# Altium schematic sheet ESP32_2020-10-03_09-20-40.schdoc
size 281 x 190 mm
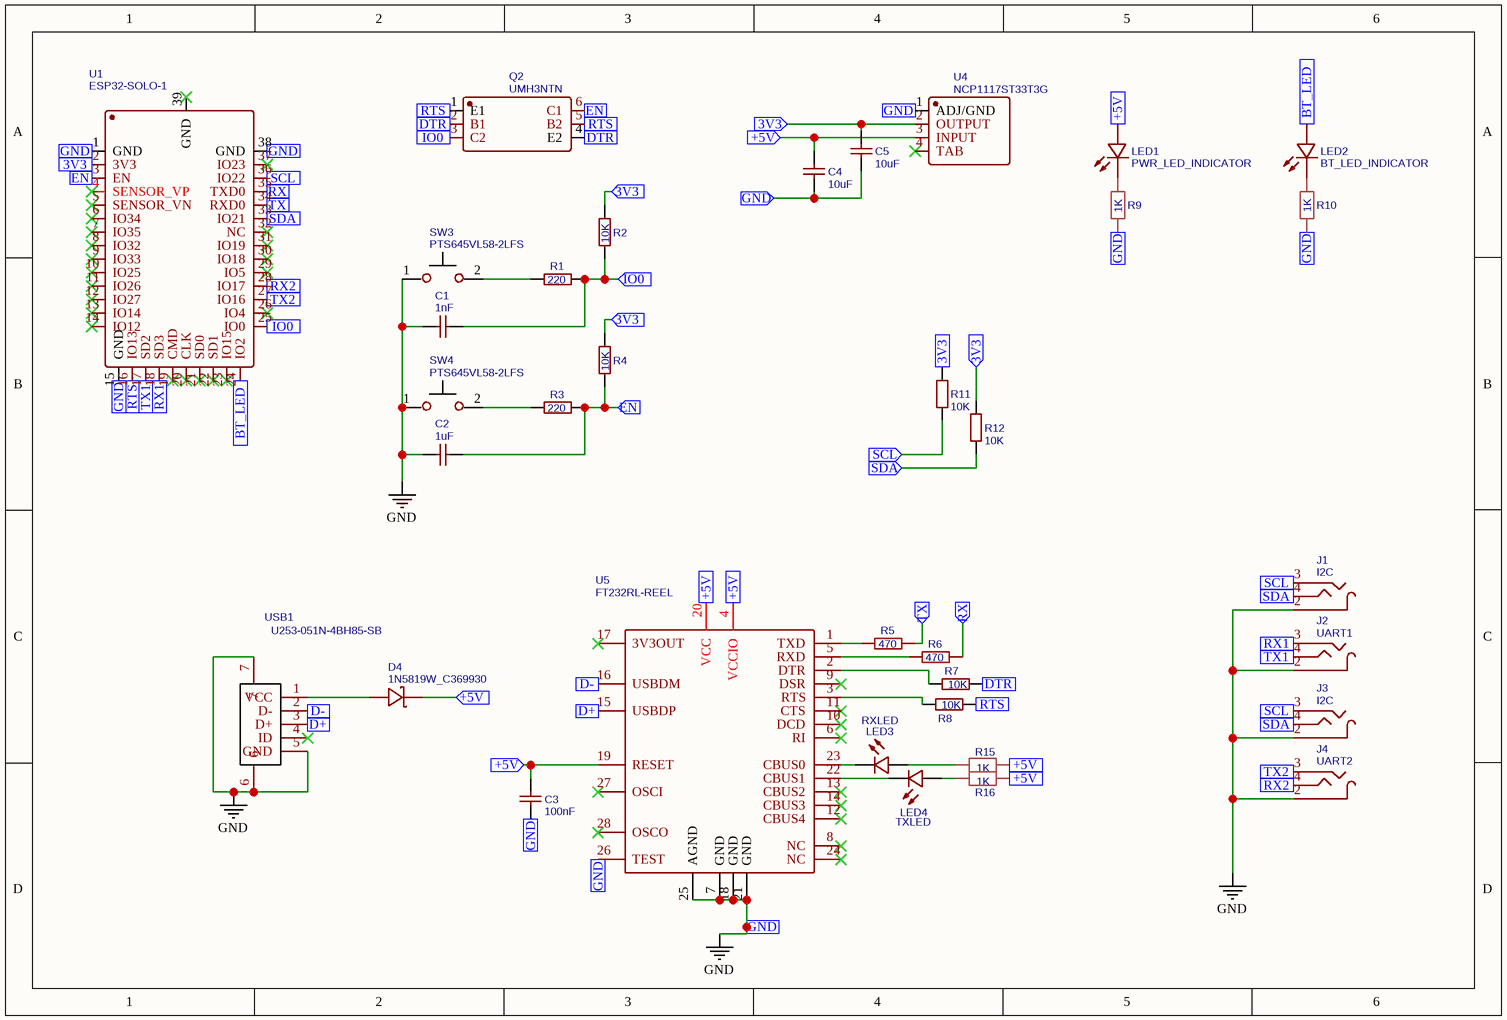
[diagram p0: ESP32_2020-10-03_09-20-40.schdoc]

## Parts
C1  1nF  [C1206]
C2  1uF  [C1206]
C3  100nF  [C1206]
C4  10uF  [C1206]
C5  10uF  [C1206]
D4  1N5819W_C369930  [SOD-123_L2.8-W1.8-LS3.7-RD]
J1  I2C  [AUDIO-TH_PJ313D]
J2  UART1  [AUDIO-TH_PJ313D]
J3  I2C  [AUDIO-TH_PJ313D]
J4  UART2  [AUDIO-TH_PJ313D]
LED1  PWR_LED_INDICATOR  [LED1206-R-RD]
LED2  BT_LED_INDICATOR  [LED1206-R-RD]
LED3  RXLED  [LED1206-R-RD]
LED4  TXLED  [LED1206-R-RD]
Q2  UMH3NTN  [SOT-363_L2.0-W1.3-P0.65-LS2.1-TL]
R1  220  [R1206]
R2  10K  [R1206]
R3  220  [R1206]
R4  10K  [R1206]
R5  470  [R1206]
R6  470  [R1206]
R7  10K  [R1206]
R8  10K  [R1206]
R9  1K  [_1206MP]
R10  1K  [_1206MP]
R11  10K  [R1206]
R12  10K  [R1206]
R15  1K  [_1206MP]
R16  1K  [_1206MP]
SW3  PTS645VL58-2LFS  [KEY-7.0*7.0]
SW4  PTS645VL58-2LFS  [KEY-7.0*7.0]
U1  ESP32-SOLO-1  [WIFIM-SMD_38P-L25.5-W18.0-P1.27]
U4  NCP1117ST33T3G  [SOT-223-3_L6.5-W3.4-P2.30-LS7.0-BR]
U5  FT232RL-REEL  [SSOP-28_L10.2-W5.3-P0.65-LS7.8-BL]
USB1  U253-051N-4BH85-SB  [MICRO-USB-SMD_U253-051T-4BH85-SB]

## Ports
3V3 (in), +5V (in), BT_LED (in), D+ (in), D- (in), DTR (in), EN (in), GND (in), IO0 (in), RTS (in), RX1 (in), RX2 (in), RX (in), SCL (in), SDA (in), TX1 (in), TX2 (in), TX (in)

## Nets
GND: C1.1 C2.1 C3.1 C4.1 C5.1 J1.2 J2.2 J3.2 J4.2 R9.1 R10.1 SW3.1 SW4.1 U1.1(GND) U1.15(GND) U1.38(GND) U4.1(ADJ/GND) U5.7(GND) U5.18(GND) U5.21(GND) U5.25(AGND) U5.26(TEST) USB1.5(GND) USB1.6 USB1.7 ; port GND
3V3: C5.2 R2.2 R4.2 R11.2 R12.2 U1.2(3V3) U4.2(OUTPUT) ; port 3V3
+5V: C3.2 C4.2 D4.1(K) LED1.1(A) R15.2 R16.2 U4.3(INPUT) U5.4(VCCIO) U5.19(RESET) U5.20(VCC) ; port +5V
BT_LED: LED2.1(A) U1.24(IO2) ; port BT_LED
D+: U5.15(USBDP) USB1.3(D+) ; port D+
D-: U5.16(USBDM) USB1.2(D-) ; port D-
DTR: Q2.2(B1) Q2.4(E2) R7.2 ; port DTR
EN: C2.2 Q2.6(C1) R3.2 R4.1 U1.3(EN) ; port EN
IO0: C1.2 Q2.3(C2) R1.2 R2.1 U1.25(IO0) ; port IO0
RTS: Q2.1(E1) Q2.5(B2) R8.2 U1.16(IO13) ; port RTS
RX: R6.2 U1.35(TXD0) ; port RX
RX1: J2.3 U1.18(SD3) ; port RX1
RX2: J4.4 U1.28(IO17) ; port RX2
SCL: J1.3 J3.3 R11.1 U1.36(IO22) ; port SCL
SDA: J1.4 J3.4 R12.1 U1.33(IO21) ; port SDA
TX: R5.2 U1.34(RXD0) ; port TX
TX1: J2.4 U1.17(SD2) ; port TX1
TX2: J4.3 U1.27(IO16) ; port TX2
NetD4_2: D4.2(A) USB1.1(VCC)
NetLED1_2: LED1.2(K) R9.2
NetLED2_2: LED2.2(K) R10.2
NetLED3_1: LED3.1(A) R15.1
NetLED3_2: LED3.2(C) U5.23(CBUS0)
NetLED4_1: LED4.1(A) R16.1
NetLED4_2: LED4.2(C) U5.22(CBUS1)
NetR1_1: R1.1 SW3.2
NetR3_1: R3.1 SW4.2
NetR5_1: R5.1 U5.1(TXD)
NetR6_1: R6.1 U5.5(RXD)
NetR7_1: R7.1 U5.2(DTR)
NetR8_1: R8.1 U5.3(RTS)

Not connected (* = marked no-connect by the designer): U1 4(SENSOR_VP)* 5(SENSOR_VN)* 6(IO34)* 7(IO35)* 8(IO32)* 9(IO33)* 10(IO25)* 11(IO26)* 12(IO27)* 13(IO14)* 14(IO12)* 19(CMD)* 20(CLK)* 21(SD0)* 22(SD1)* 23(IO15)* 26(IO4)* 29(IO5)* 30(IO18)* 31(IO19)* 32(NC)* 37(IO23)* 39(GND)*; U4 4(TAB)*; U5 6(RI)* 8(NC)* 9(DSR)* 10(DCD)* 11(CTS)* 12(CBUS4)* 13(CBUS2)* 14(CBUS3)* 17(3V3OUT)* 24(NC)* 27(OSCI)* 28(OSCO)*; USB1 4(ID)*

## Library data of the parts
C1 = 1nF: BOM_Manufacturer: FH; BOM_Manufacturer Part: 1206B102K500NT; nameAlias: Capacitance; BOM_Supplier: LCSC; BOM_Supplier Part: C1845; spicePre: C; spiceSymbolName: 1206B102K500NT
C2 = 1uF: BOM_Manufacturer: FH; BOM_Manufacturer Part: 1206B102K500NT; nameAlias: Capacitance; BOM_Supplier: LCSC; BOM_Supplier Part: C1845; spicePre: C; spiceSymbolName: 1206B102K500NT
C3 = 100nF: BOM_Manufacturer Part: CL31B104KBCNNNC; BOM_Manufacturer: SAMSUNG; nameAlias: Capacitance; SMT Type: Basic; BOM_Supplier: LCSC; BOM_LCSC Assembly: Yes; BOM_Supplier Part: C24497; spicePre: C; spiceSymbolName: CL31B104KBCNNNC
C4 C5 = 10uF: BOM_Manufacturer Part: CL31A106KAHNNNE; BOM_Manufacturer: SAMSUNG; nameAlias: Capacitance; BOM_Supplier: LCSC; BOM_Supplier Part: C9807; spicePre: C; spiceSymbolName: CL31A106KAHNNNE
D4 = 1N5819W_C369930: BOM_Manufacturer: KEXIN; Contributor: LCSC; SMT Type: Extend; BOM_Supplier: LCSC; BOM_Supplier Part: C369930; BOM_Manufacturer Part: 1N5819W; BOM_LCSC Assembly: Yes; spicePre: D; spiceSymbolName: 1N5819W_C369930
J1 J3 = I2C: BOM_Manufacturer: BOOMELE; BOM_Manufacturer Part: PJ313D; BOM_Supplier: LCSC; BOM_Supplier Part: C18167; spicePre: J; spiceSymbolName: PJ313D
J2 = UART1: BOM_Manufacturer: BOOMELE; BOM_Manufacturer Part: PJ313D; BOM_Supplier: LCSC; BOM_Supplier Part: C18167; spicePre: J; spiceSymbolName: PJ313D
J4 = UART2: BOM_Manufacturer: BOOMELE; BOM_Manufacturer Part: PJ313D; BOM_Supplier: LCSC; BOM_Supplier Part: C18167; spicePre: J; spiceSymbolName: PJ313D
LED1 = PWR_LED_INDICATOR: BOM_Manufacturer: NATIONSTAR; BOM_Manufacturer Part: FC-3215HRK-620D; SMT Type: Extend; BOM_Supplier: LCSC; image: //image.lceda.cn/szlcsc/C84270.jpg; BOM_Supplier Part: C84270; BOM_LCSC Assembly: Yes; spicePre: L; spiceSymbolName: FC-3215HRK-620D
LED2 = BT_LED_INDICATOR: BOM_Manufacturer: NATIONSTAR; BOM_Manufacturer Part: FC-3215HRK-620D; SMT Type: Extend; BOM_Supplier: LCSC; image: //image.lceda.cn/szlcsc/C84270.jpg; BOM_Supplier Part: C84270; BOM_LCSC Assembly: Yes; spicePre: L; spiceSymbolName: FC-3215HRK-620D
LED3 = RXLED: BOM_Manufacturer: EVERLIGHT; BOM_Manufacturer Part: 15-21SYGC/S530-E2/TR8; SMT Type: Extend; BOM_Supplier: LCSC; image: //image.lceda.cn/szlcsc/C73550.jpg; BOM_Supplier Part: C73550; BOM_LCSC Assembly: Yes; spicePre: L; spiceSymbolName: 15-21SYGC/S530-E2/TR8
LED4 = TXLED: BOM_Manufacturer: EVERLIGHT; BOM_Manufacturer Part: 15-21SYGC/S530-E2/TR8; SMT Type: Extend; BOM_Supplier: LCSC; image: //image.lceda.cn/szlcsc/C73550.jpg; BOM_Supplier Part: C73550; BOM_LCSC Assembly: Yes; spicePre: L; spiceSymbolName: 15-21SYGC/S530-E2/TR8
Q2 = UMH3NTN: BOM_Manufacturer: ROHM; Contributor: LCSC; SMT Type: Extend; BOM_Supplier: LCSC; BOM_Manufacturer Part: UMH3NTN; BOM_Supplier Part: C123008; BOM_LCSC Assembly: Yes; spicePre: Q; spiceSymbolName: UMH3NTN
R1 R3 = 220: BOM_Manufacturer: LIZ; BOM_Manufacturer Part: CR1206F42200G; nameAlias: Resistance (Ohms); BOM_Supplier: LCSC; BOM_Supplier Part: C102128; spicePre: R; spiceSymbolName: CR1206F42200G
R2 R4 = 10K: BOM_Manufacturer: UniOhm; BOM_Manufacturer Part: 1206W4F1002T5E; nameAlias: Resistance (Ohms); SMT Type: Basic; BOM_Supplier: LCSC; BOM_LCSC Assembly: Yes; BOM_Supplier Part: C17902; spicePre: R; spiceSymbolName: 1206W4F1002T5E
R5 R6 = 470: BOM_Manufacturer: Hong Kong Resistors; BOM_Manufacturer Part: RCT06470RFLF; nameAlias: Resistance (Ohms); Contributor: LCSC; BOM_Supplier: LCSC; BOM_Supplier Part: C185720; spicePre: R; spiceSymbolName: RCT06470RFLF
R7 R8 R11 R12 = 10K: BOM_Manufacturer: UniOhm; BOM_Manufacturer Part: 1206W4J0102T5E; nameAlias: Resistance (Ohms); BOM_Supplier: LCSC; BOM_Supplier Part: C1469; spicePre: R; spiceSymbolName: 1206W4J0102T5E
R9 R10 R15 R16 = 1K: Contributor: otisbyron; spicePre: R
SW3 SW4 = PTS645VL58-2LFS: BOM_Manufacturer: C&K; Contributor: LCSC; BOM_Supplier: LCSC; BOM_Supplier Part: C221892; BOM_Manufacturer Part: PTS645VL58-2LFS; spicePre: S
U1 = ESP32-SOLO-1: BOM_Manufacturer: Espressif Systems; Contributor: LCSC; BOM_Supplier: LCSC; BOM_Supplier Part: C473005; BOM_Manufacturer Part: ESP32-SOLO-1; spicePre: U; spiceSymbolName: ESP32-SOLO-1
U4 = NCP1117ST33T3G: BOM_Manufacturer: ON; SMT Type: Extend; timeStamp: 1466353290; BOM_Supplier: LCSC; BOM_Manufacturer Part: NCP1117ST33T3G; image: //image.lceda.cn/szlcsc/C26537.jpg; BOM_Supplier Part: C26537; BOM_LCSC Assembly: Yes; spicePre: U; spiceSymbolName: NCP1117ST33T3G
U5 = FT232RL-REEL: BOM_Manufacturer: FTDI; SMT Type: Basic; BOM_Supplier: LCSC; BOM_Manufacturer Part: FT232RL-REEL; BOM_LCSC Assembly: Yes; image: //image.lceda.cn/szlcsc/C8690.jpg; BOM_Supplier Part: C8690; spicePre: U
USB1 = U253-051N-4BH85-SB: BOM_Manufacturer: XKB Enterprise; Contributor: LCSC; BOM_Supplier: LCSC; BOM_Supplier Part: C319177; BOM_Manufacturer Part: U253-051N-4BH85-SB; spicePre: U; spiceSymbolName: U253-051N-4BH85-SB